# Altium schematic sheet Clamp.SchDoc
size 406 x 304 mm; SheetNumber: 14; SheetTotal: 18
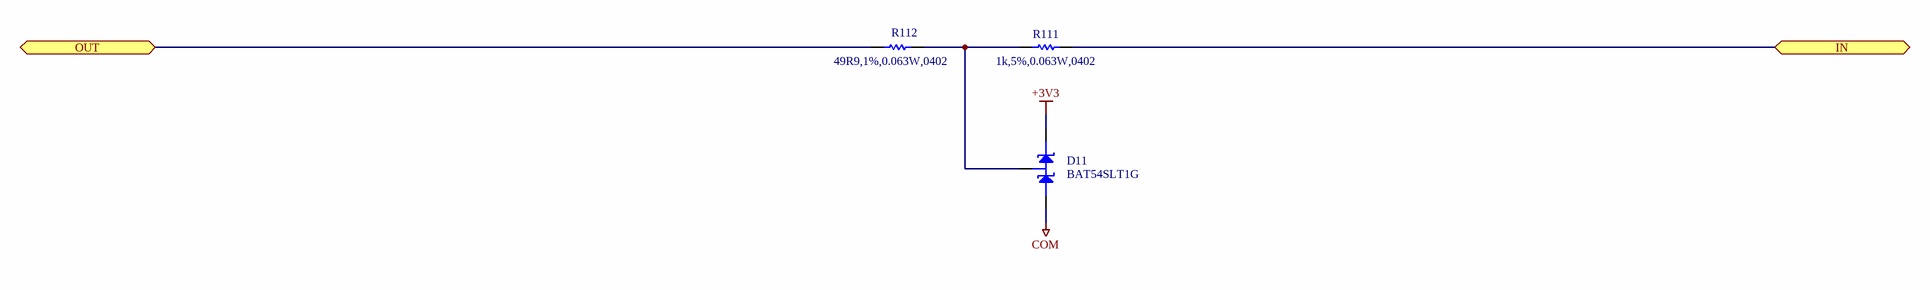
[diagram p0: Clamp.SchDoc]

## Parts
D11  BAT54SLT1G  [SOT95P240X120-3N]
R111  1k,5%,0.063W,0402  [RESC1005X04N]
R112  49R9,1%,0.063W,0402  [RESC1005X04N]

## Ports
IN (bidir), OUT (bidir)

## Nets
+3V3: D11.2(C)
COM: D11.1(A)
IN: R111.2 ; port IN
OUT: R112.1 ; port OUT
NetD11_3: D11.3(C/A) R111.1 R112.2

## Notes on the sheet
- Rev
- Sheet Name:
- Date:
- Sheet
- Designer:
- of

## Library data of the parts
D11 = DIODE,Array,Schottky,Series,30V,200mA,SOT23: Diode Array 1 Pair Series Connection 30 V 200mA (DC) Surface Mount TO-236-3, SC-59, SOT-23-3; Manufacturer 1: onsemi; Vendor 1 Part Number: BAT54SLT1GOSCT-ND; Vendor 1: Digikey; Part Name: DIODE,Array,Schottky,Series,30V,200mA,SOT23; CreatedBy: Judd Foster; HelpURL: https://www.onsemi.com/pdf/datasheet/bat54slt1-d.pdf; Manufacturer 1 Part Number: BAT54SLT1G
R111 = RES,1k,5%,0.063W,0402: 1 kOhms ï¿½5% 0.063W, 1/16W Chip Resistor 0402 (1005 Metric) Automotive AEC-Q200 Thick Film; Manufacturer 1: Stackpole Electronics Inc; Manufacturer 1 Part Number: RMCF0402JT1K00; Vendor 1 Part Number: RMCF0402JT1K00CT-ND; Vendor 1: DIgikey; Part Name: RES,1k,5%,0.063W,0402; CreatedBy: Judd Foster; HelpURL: https://www.seielect.com/catalog/sei-rmcf_rmcp.pdf; Value: 1k
R112 = RES,49R9,1%,0.063W,0402: 49.9 Ohms Â±1% 0.063W, 1/16W Chip Resistor 0402 (1005 Metric) Moisture Resistant Thick Film; Manufacturer 1: YAGEO; Manufacturer 1 Part Number: RC0402FR-0749R9L; Vendor 1 Part Number: 311-49.9LRCT-ND; Vendor 1: DigiKey; Value: 49.9; Part Name: RES,49R9,1%,0.063W,0402; CreatedBy: Judd Foster; HelpURL: https://www.yageo.com/upload/media/product/products/datasheet/rchip/PYu-RC_Group_51_RoHS_L_12.pdf